# Altium project 8Relay_Module_Breakout.PrjPcb
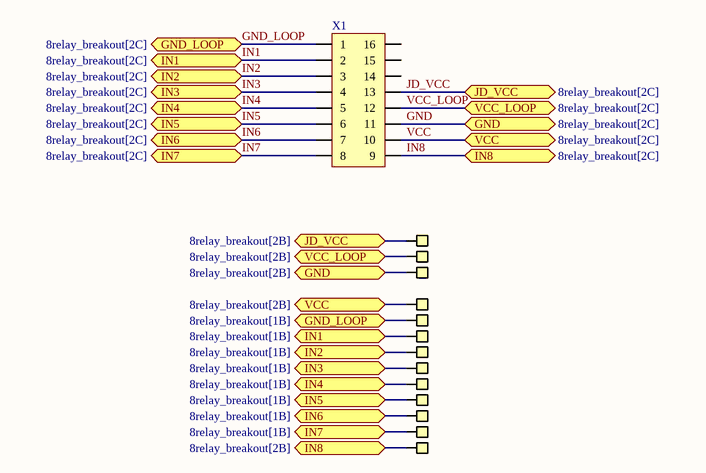
[diagram p0: 8relay_breakout.SchDoc]
1 sheet, 14 parts. Net scope: flat (ports and power ports of the same name join across sheets).
Board file: 8relay_breakout.PcbDoc

## Sheet 8relay_breakout.SchDoc
size A; SheetNumber: 1; SheetTotal: 1

### Parts
X1  TERM BLOCK 16POS 45DEG 5MM PCB  [PHEONIX-1988943]  (value not drawn)
X2  GenericPinHeader(0.1in)  [GenericPinHeader(.1in)]  (value not drawn)
X3  GenericPinHeader(0.1in)  [GenericPinHeader(.1in)]  (value not drawn)
X4  GenericPinHeader(0.1in)  [GenericPinHeader(.1in)]  (value not drawn)
X5  GenericPinHeader(0.1in)  [GenericPinHeader(.1in)]  (value not drawn)
X6  GenericPinHeader(0.1in)  [GenericPinHeader(.1in)]  (value not drawn)
X7  GenericPinHeader(0.1in)  [GenericPinHeader(.1in)]  (value not drawn)
X8  GenericPinHeader(0.1in)  [GenericPinHeader(.1in)]  (value not drawn)
X9  GenericPinHeader(0.1in)  [GenericPinHeader(.1in)]  (value not drawn)
X10  GenericPinHeader(0.1in)  [GenericPinHeader(.1in)]  (value not drawn)
X11  GenericPinHeader(0.1in)  [GenericPinHeader(.1in)]  (value not drawn)
X12  GenericPinHeader(0.1in)  [GenericPinHeader(.1in)]  (value not drawn)
X13  GenericPinHeader(0.1in)  [GenericPinHeader(.1in)]  (value not drawn)
X14  GenericPinHeader(0.1in)  [GenericPinHeader(.1in)]  (value not drawn)

### Ports
GND (bidir, see 8relay_breakout[2B]), GND (bidir, see 8relay_breakout[2C]), GND_LOOP (bidir, see 8relay_breakout[1B]), GND_LOOP (bidir, see 8relay_breakout[2C]), IN1 (bidir, see 8relay_breakout[1B]), IN1 (bidir, see 8relay_breakout[2C]), IN2 (bidir, see 8relay_breakout[1B]), IN2 (bidir, see 8relay_breakout[2C]), IN3 (bidir, see 8relay_breakout[1B]), IN3 (bidir, see 8relay_breakout[2C]), IN4 (bidir, see 8relay_breakout[1B]), IN4 (bidir, see 8relay_breakout[2C]), IN5 (bidir, see 8relay_breakout[1B]), IN5 (bidir, see 8relay_breakout[2C]), IN6 (bidir, see 8relay_breakout[1B]), IN6 (bidir, see 8relay_breakout[2C]), IN7 (bidir, see 8relay_breakout[1B]), IN7 (bidir, see 8relay_breakout[2C]), IN8 (bidir, see 8relay_breakout[2B]), IN8 (bidir, see 8relay_breakout[2C]), JD_VCC (bidir, see 8relay_breakout[2B]), JD_VCC (bidir, see 8relay_breakout[2C]), VCC (bidir, see 8relay_breakout[2B]), VCC (bidir, see 8relay_breakout[2C]), VCC_LOOP (bidir, see 8relay_breakout[2B]), VCC_LOOP (bidir, see 8relay_breakout[2C])

### Nets
GND: X1.11 X2.1(Pin) ; port GND
GND_LOOP: X1.1 X4.1(Pin) ; port GND_LOOP
IN1: X1.2 X5.1(Pin) ; port IN1
IN2: X1.3 X6.1(Pin) ; port IN2
IN3: X1.4 X7.1(Pin) ; port IN3
IN4: X1.5 X8.1(Pin) ; port IN4
IN5: X1.6 X9.1(Pin) ; port IN5
IN6: X1.7 X10.1(Pin) ; port IN6
IN7: X1.8 X11.1(Pin) ; port IN7
IN8: X1.9 X12.1(Pin) ; port IN8
JD_VCC: X1.13 X13.1(Pin) ; port JD_VCC
VCC: X1.10 X3.1(Pin) ; port VCC
VCC_LOOP: X1.12 X14.1(Pin) ; port VCC_LOOP

Not connected (* = marked no-connect by the designer): X1 14 15 16

### Library data of the parts
X1 = PHEONIX-1988943: 16 Position Wire to Board Terminal Block 45° (135°) Angle with Board 0.197" (5.00mm) Through Hole; ComponentLink1Description: DIGIKEY; ComponentLink1URL: https://www.digikey.com/en/products/detail/phoenix-contact/1988943/950906
X2-X14 = GenericPinHeader(0.1in): Generic .1in(2.54mm) pitch pin header